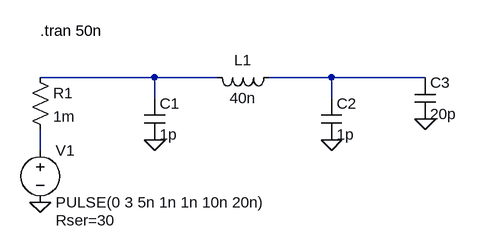
[diagram p0: schematic SPITrace.asc]
SPITrace.asc, the LTspice schematic file:
Version 4
SHEET 1 880 680
WIRE 128 0 -48 0
WIRE 224 0 128 0
WIRE 400 0 304 0
WIRE 544 0 400 0
WIRE 128 32 128 0
WIRE 400 32 400 0
WIRE -48 112 -48 80
FLAG -48 192 0
FLAG 128 96 0
FLAG 400 96 0
FLAG 544 64 0
SYMBOL voltage -48 96 R0
WINDOW 123 0 0 Left 0
WINDOW 39 24 124 Left 2
SYMATTR InstName V1
SYMATTR Value PULSE(0 3 5n 1n 1n 10n 20n)
SYMATTR SpiceLine Rser=30
SYMBOL res -64 -16 R0
SYMATTR InstName R1
SYMATTR Value 1m
SYMBOL cap 112 32 R0
SYMATTR InstName C1
SYMATTR Value 1p
SYMBOL cap 384 32 R0
SYMATTR InstName C2
SYMATTR Value 1p
SYMBOL ind 320 -16 R90
WINDOW 0 5 56 VBottom 2
WINDOW 3 32 56 VTop 2
SYMATTR InstName L1
SYMATTR Value 40n
SYMBOL cap 528 0 R0
SYMATTR InstName C3
SYMATTR Value 20p
TEXT -48 -72 Left 2 !.tran 50n

The netlist it stands for:
* SPITrace.asc
V1 N003 0 PULSE(0 3 5n 1n 1n 10n 20n) Rser=30
R1 N001 N003 1m
C1 N001 0 1p
C2 N002 0 1p
L1 N002 N001 40n
C3 N002 0 20p
.tran 50n
.backanno
.end